# Altium schematic sheet Power_Sheet.SchDoc
size A4; SheetNumber: 2; SheetTotal: 2
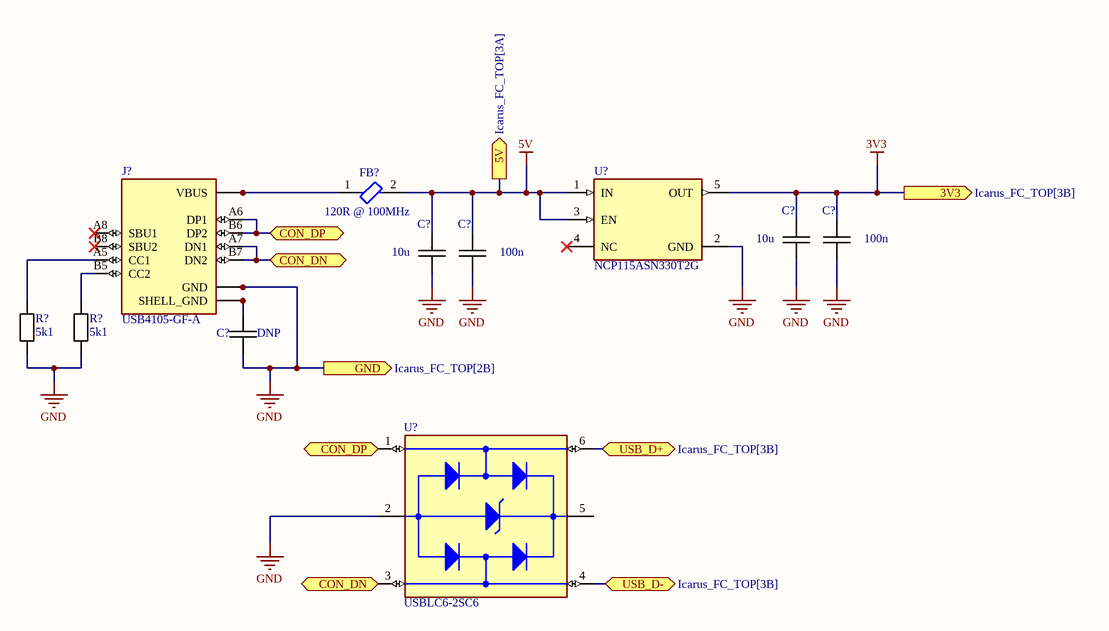
[diagram p0: Power_Sheet.SchDoc]

## Parts
(Parts that share a designator on the sheet are numbered #1, #2 ... from top to bottom, then left to right.)
C?#1  10u  [CAP_0603]
C?#2  100n  [CAP_0603]
C?#3  10u  [CAP_0603]
C?#4  100n  [CAP_0603]
C?#5  DNP  [CAP_0603]
FB?  120R @ 100MHz  [FP-LI0603-MFG]
J?  USB4105-GF-A  [GCT_USB4105-GF-A]
R?#1  5k1  [RES_0603]
R?#2  5k1  [RES_0603]
U?#1  NCP115ASN330T2G  [SOT95P275X110-5N]
U?#2  USBLC6-2SC6  [SOT95P280X145-6N]

## Ports
3V3 (out, see Icarus_FC_TOP[3B]), 5V (out, see Icarus_FC_TOP[3A]), CON_DN (bidir), CON_DP (bidir), GND (out, see Icarus_FC_TOP[2B]), USB_D+ (bidir, see Icarus_FC_TOP[3B]), USB_D- (bidir, see Icarus_FC_TOP[3B])

## Nets
3V3: U?#1.5(OUT) ; port 3V3
5V: FB?.2 U?#1.1(IN) U?#1.3(EN) ; port 5V
GND: J?.A1_B12(GND) J?.B1_A12(GND) R?#1.1 R?#2.1 U?#1.2(GND) U?#2.2(GND) ; port GND
CON_DN: J?.A7(DN1) J?.B7(DN2) U?#2.3(I/O2_IN) ; port CON_DN
CON_DP: J?.A6(DP1) J?.B6(DP2) U?#2.1(I/O1_IN) ; port CON_DP
USB_D+: U?#2.6(I/O1_OUT) ; port USB_D+
USB_D-: U?#2.4(I/O2_OUT) ; port USB_D-
NetFB?_1: FB?.1 J?.A4_B9(VBUS) J?.B4_A9(VBUS)
NetJ?_A5: J?.A5(CC1) R?#1.2
NetJ?_B5: J?.B5(CC2) R?#2.2
NetJ?_S1: J?.S1(SHELL_GND) J?.S2(SHELL_GND) J?.S3(SHELL_GND) J?.S4(SHELL_GND)

Not connected (* = marked no-connect by the designer): J? A8(SBU1)* B8(SBU2)*; U?#1 4(NC)*; U?#2 5(VBUS)

## Library data of the parts
C?#1-C?#5 = CAP_0603
FB? = CMP-19111-000012-1: FERRITE BEAD 120 OHM 0603 1LN; Number of Lines: 1; DC Resistance (DCR): 200mR; Max DC Current: 700mA; Min Operating Temperature: -40°C; Height: 0.8mm; Test Frequency: 100MHz; Depth: 0.8mm; Mount: Surface Mount; Case Code (Metric): 1608; Weight: 0.002oz; Width: 0.8mm; Package Quantity: 1; Contact Plating: Tin; Length: 1.6mm; Max Operating Temperature: 125°C; Case Code (Imperial): 0603; Core Material: Ferrite; Case/Package: 0603; Packaging: Tape and Reel; Max Current Rating: 700mA; Impedance: 120R; Termination: SMD/SMT; Frequency: 100MHz; Lead Free: Lead Free
J? = USB4105-GF-A: USB-C (USB TYPE-C) USB 2.0 Receptacle Connector 24 (16+8 Dummy) Position Surface Mount, Right Angle; Through Hole; MF: GCT; SnapEDA_Link: https://www.snapeda.com/parts/USB4105-GF-A/Global+Connector+Technology/view-part/?ref=snap; Package: None; Value: *; MP: USB4105-GF-A; Check_prices: https://www.snapeda.com/parts/USB4105-GF-A/Global+Connector+Technology/view-part/?ref=eda
R?#1 R?#2 = RES_0603: Resistor SMD 0603 Generic; Manufacturer: *; Manufacturer Part Number: *; Tolerance: *; Package Size: *; Resistance Value: *; Power Rating: *
U?#1 = NCP115ASN330T2G: MF: {'manufacturer': u'onsemi'}; Package: None; Price: None; Value: *; MP: NCP115ASN330T2G; Availability: Unavailable
U?#2 = USBLC6-2SC6: 17V Clamp 5A (8/20Âµs) Ipp Tvs Diode Surface Mount SOT-23-6; MF: STMicroelectronics; SnapEDA_Link: https://www.snapeda.com/parts/USBLC6-2SC6/STMicroelectronics/view-part/?ref=snap; Package: SOT-23-6 STMicroelectronics; Value: *; MP: USBLC6-2SC6; Check_prices: https://www.snapeda.com/parts/USBLC6-2SC6/STMicroelectronics/view-part/?ref=eda